# EAGLE design FLXWTCH_OLED (EAGLE 9.6.2)
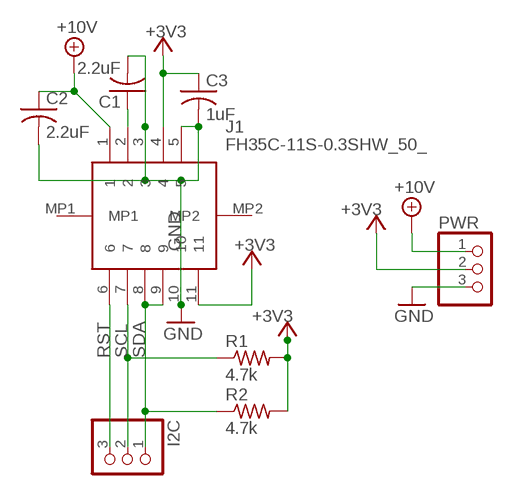
[diagram p0: schematic, sheet 1]

## Parts
C1  2.2uF  C-USC0603K  [C0603K]
C2  2.2uF  C-USC0603K  [C0603K]
C3  1uF  C-USC0603K  [C0603K]
I2C  PINHD-1X3  [1X03]
J1  FH35C-11S-0.3SHW_50_  [FH35C11S03SHW50]
PWR  PINHD-1X3  [1X03]
R1  4.7k  R-US_R0603  [R0603]
R2  4.7k  R-US_R0603  [R0603]

## Nets
+3V3: C3.1 J1.4 J1.11 PWR.2 R1.2 R2.2
+10V: C2.1 J1.1 PWR.1
GND: C1.2 C2.2 C3.2 J1.3 J1.5 J1.10 PWR.3
N$2: C1.1 J1.2
RST: I2C.3 J1.6
SCL: I2C.2 J1.7 R1.1
SDA: I2C.1 J1.8 J1.9 R2.1
Unconnected: J1.MP1 J1.MP2

## Library data of the parts
C1-C3 = adafruit:C-US: CAPACITOR, American symbol
I2C PWR = adafruit:PINHD-1X3: PIN HEADER
J1 = FH35C-11S-0.3SHW_50_:FH35C-11S-0.3SHW_50_: FFC & FPC Connectors 11P BCKFLP DUAL-SIDE FPC 0.3mm P 0.9mm H Source: Datasheet <http://www.mouser.com/datasheet/2/185/FH35C_catalog-939278.pdf>; DESCRIPTION: FFC & FPC Connectors 11P BCKFLP DUAL-SIDE FPC 0.3mm P 0.9mm H; HEIGHT: 1.8mm; MANUFACTURER_NAME: Hirose; MANUFACTURER_PART_NUMBER: FH35C-11S-0.3SHW(50); MOUSER_PART_NUMBER: 798-FH35C11S03SHW50; MOUSER_PRICE-STOCK: https://www.mouser.com/Search/Refine.aspx?Keyword=798-FH35C11S03SHW50
R1 R2 = rcl:R-US_: RESISTOR, American symbol; SPICEPREFIX: R

## Board
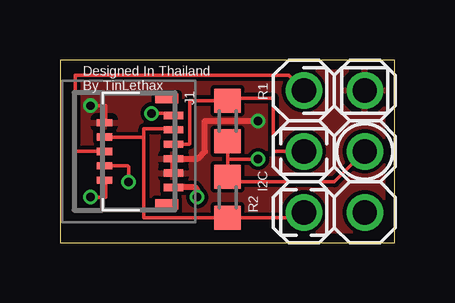
[diagram p1: board, top side]
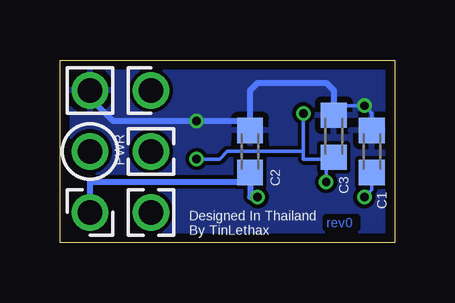
[diagram p2: board, bottom side, seen from below]

Size 13.95 x 7.62 mm. Coordinates in mm from the lower left corner, seen from the top.
Outline: 0,0 13.95,0 13.95,7.62 0,7.62 0,0
Copper layers (1*16): Top 0.035559375mm / dielectric 1.6mm / Bottom 0.035559375mm
Design rules "oshpark-2layer": minimum track width 6mil, minimum drill 10mil, track to track 6mil, track to pad 6mil, pad to pad 6mil, via to via 6mil, smd to smd 6mil, copper to edge 15mil, drill to drill 6mil, minimum pad ring 5mil, minimum via ring 5mil, stop-mask expansion 2.5mil, vias tented up to drill 0mil, thermal gap 10mil

### Footprints (pad centres in the part's own frame; a part is rotated, then mirrored left to right if it is on the bottom)
C0603K = smd 1.05 x 1.08: 1 -0.875,0; 2 0.875,0
1X03 = drill 1.016: 1 -2.54,0; 2 0,0; 3 2.54,0
FH35C11S03SHW50 = smd 0.3 x 0.8: 1 -1.5,-1.869; 3 -0.9,-1.869; 5 -0.3,-1.869; 7 0.3,-1.869; 9 0.9,-1.869; 11 1.5,-1.869 | smd 0.3 x 0.65: 2 -1.2,1.006; 4 -0.6,1.006; 6 0,1.006; 8 0.6,1.006; 10 1.2,1.006 | smd 0.4 x 0.95: MP1 -2.2,-1.594; MP2 2.2,-1.594
R0603 = smd 1 x 1.1: 1 -0.85,0; 2 0.85,0

### Placement (x,y rotation side)
C1  0.95,3.81 90 bottom
C2  6.03,3.81 90 bottom
C3  2.54,4.45 90 bottom
I2C  10.16,3.81 90 top
J1  2.86,3.81 90 top
PWR  12.7,3.81 90 top
R1  6.99,5.08 270 top
R2  6.99,1.91 90 top

### Tracks (layer width: path | path; a pad name or v marks a point on that pad's centre or on a via)
+3V3  (via drill 0.35)
  Top 0.152: R1.2 6.99,3.49 | 6.99,3.49 R2.2 7.2,2.54 11.43,2.54 PWR.2 | v2.86,2.54 2.86,3.17 2.82,3.21 J1.4 | J1.11 4.64,5.4 v3.81,5.4 | 6.99,3.49 v8.26,3.49
  Bottom 0.152: C3.1 2.54,3.49 2.86,3.49 | 2.86,3.49 v2.86,2.54 | v3.81,5.4 3.81,3.81 | 3.81,3.81 3.81,3.49 2.86,3.49 | v8.26,3.49 7.3,3.49 6.99,3.81 3.81,3.81
+10V  (via drill 0.35)
  Top 0.254: v5.71,1.91 5.71,2.22 5.63,2.31 J1.1
  Bottom 0.254: C2.1 6.03,2.54 | 6.03,2.54 6.03,1.91 v5.71,1.91 | 6.03,2.54 12.7,2.54 PWR.1
GND  (via drill 0.35)
  Top 0.152: v1.27,5.71 1.91,5.71 1.91,5.06 J1.10 | J1.3 4.39,2.91
  Top 0.254: J1.3 J1.5 5.73,3.51 6.03,3.81 6.03,5.08 v8.26,5.08
  Bottom 0.152: C1.2 0.95,5.4 v1.27,5.71 2.15,5.71 C3.2
  Bottom 0.254: C2.2 6.03,5.08 | 6.03,5.08 6.03,6.35 5.71,6.67 2.86,6.67 2.54,6.35 C3.2 | PWR.3 12.7,6.03 11.75,5.08 v8.26,5.08 7.94,5.08 6.03,5.08
  pour Bottom: 0,7.62 13.97,7.62 13.97,0 0,0
  pour Top: 0,7.62 0,0 13.97,0 13.97,7.62
N$2  (via drill 0.35)
  Top 0.152: v1.27,1.91 1.91,1.91 1.91,2.56 J1.2
  Bottom 0.152: C1.1 0.95,2.22 v1.27,1.91
RST
  Top 0.152: J1.6 0.64,3.81 0.64,6.99 9.53,6.99 I2C.3
SCL
  Top 0.152: I2C.2 8.89,3.81 8.89,6.03 7.09,6.03 R1.1 5.4,5.93 5.4,4.13 5.38,4.11 J1.7
SDA
  Top 0.152: I2C.1 9.95,1.05 R2.1 3.49,1.05 3.49,4.45 | J1.8 3.46,4.41 3.49,4.45 | J1.9 4.67,4.76 3.49,4.76 3.49,4.45

### Text on the board
Bottom: rev0
tNames: Designed In Thailand / By TinLethax
bNames: Designed In Thailand / By TinLethax